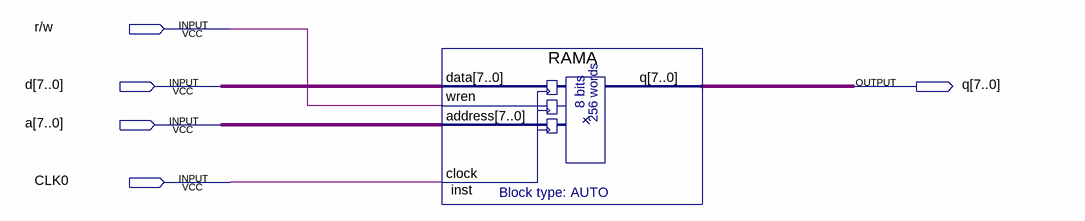
[diagram p0: schematic sheet]
// Quartus schematic RAM1.bdf as structural Verilog: 1 symbols, 5 pins
module RAM1 (
  input  \r/w ,
  input  [7:0] d,
  input  [7:0] a,
  input  CLK0,
  output [7:0] q
);

  RAMA inst (.data(d), .wren(\r/w ), .address(a), .clock(CLK0), .q(q));
endmodule
